# Altium schematic sheet 20pin_2x10_1.27mm_to_2.54mm.SchDoc
size A4
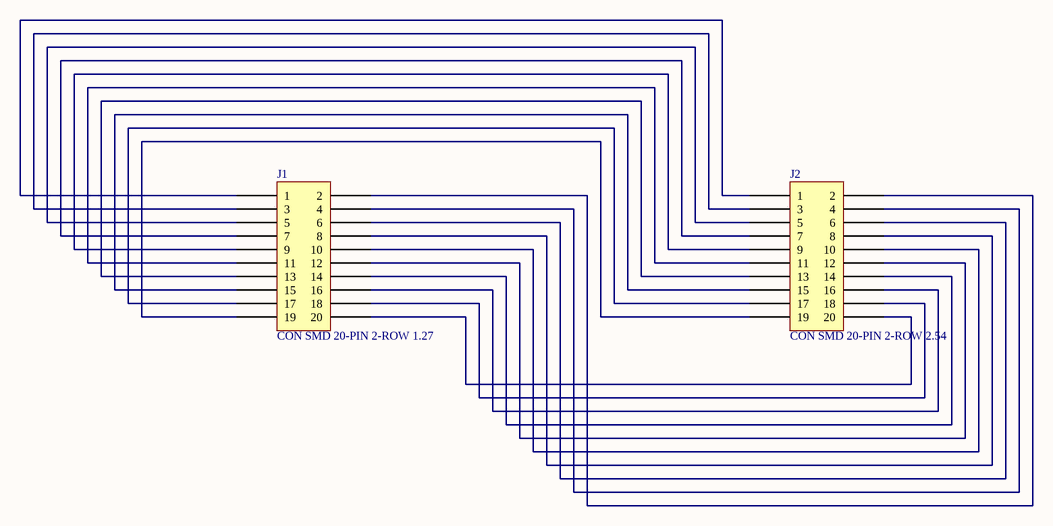
[diagram p0: 20pin_2x10_1.27mm_to_2.54mm.SchDoc]

## Parts
J1  CON SMD 20-PIN 2-ROW 1.27  [SMD HEADER 2x10 1.27]
J2  CON SMD 20-PIN 2-ROW 2.54  [SMD HEADER 2x10 2.54]

## Nets
NetJ1_1: J1.1 J2.1
NetJ1_2: J1.2 J2.2
NetJ1_3: J1.3 J2.3
NetJ1_4: J1.4 J2.4
NetJ1_5: J1.5 J2.5
NetJ1_6: J1.6 J2.6
NetJ1_7: J1.7 J2.7
NetJ1_8: J1.8 J2.8
NetJ1_9: J1.9 J2.9
NetJ1_10: J1.10 J2.10
NetJ1_11: J1.11 J2.11
NetJ1_12: J1.12 J2.12
NetJ1_13: J1.13 J2.13
NetJ1_14: J1.14 J2.14
NetJ1_15: J1.15 J2.15
NetJ1_16: J1.16 J2.16
NetJ1_17: J1.17 J2.17
NetJ1_18: J1.18 J2.18
NetJ1_19: J1.19 J2.19
NetJ1_20: J1.20 J2.20

## Library data of the parts
J1 = CON SMD 20-PIN 2-ROW 1.27: FTSH-110-01-L-DV
J2 = CON SMD 20-PIN 2-ROW 2.54: HTSS-110-01-L-DV